# EAGLE design SparkFun_LS20126-Breakout-v11 (EAGLE 7.2.0)
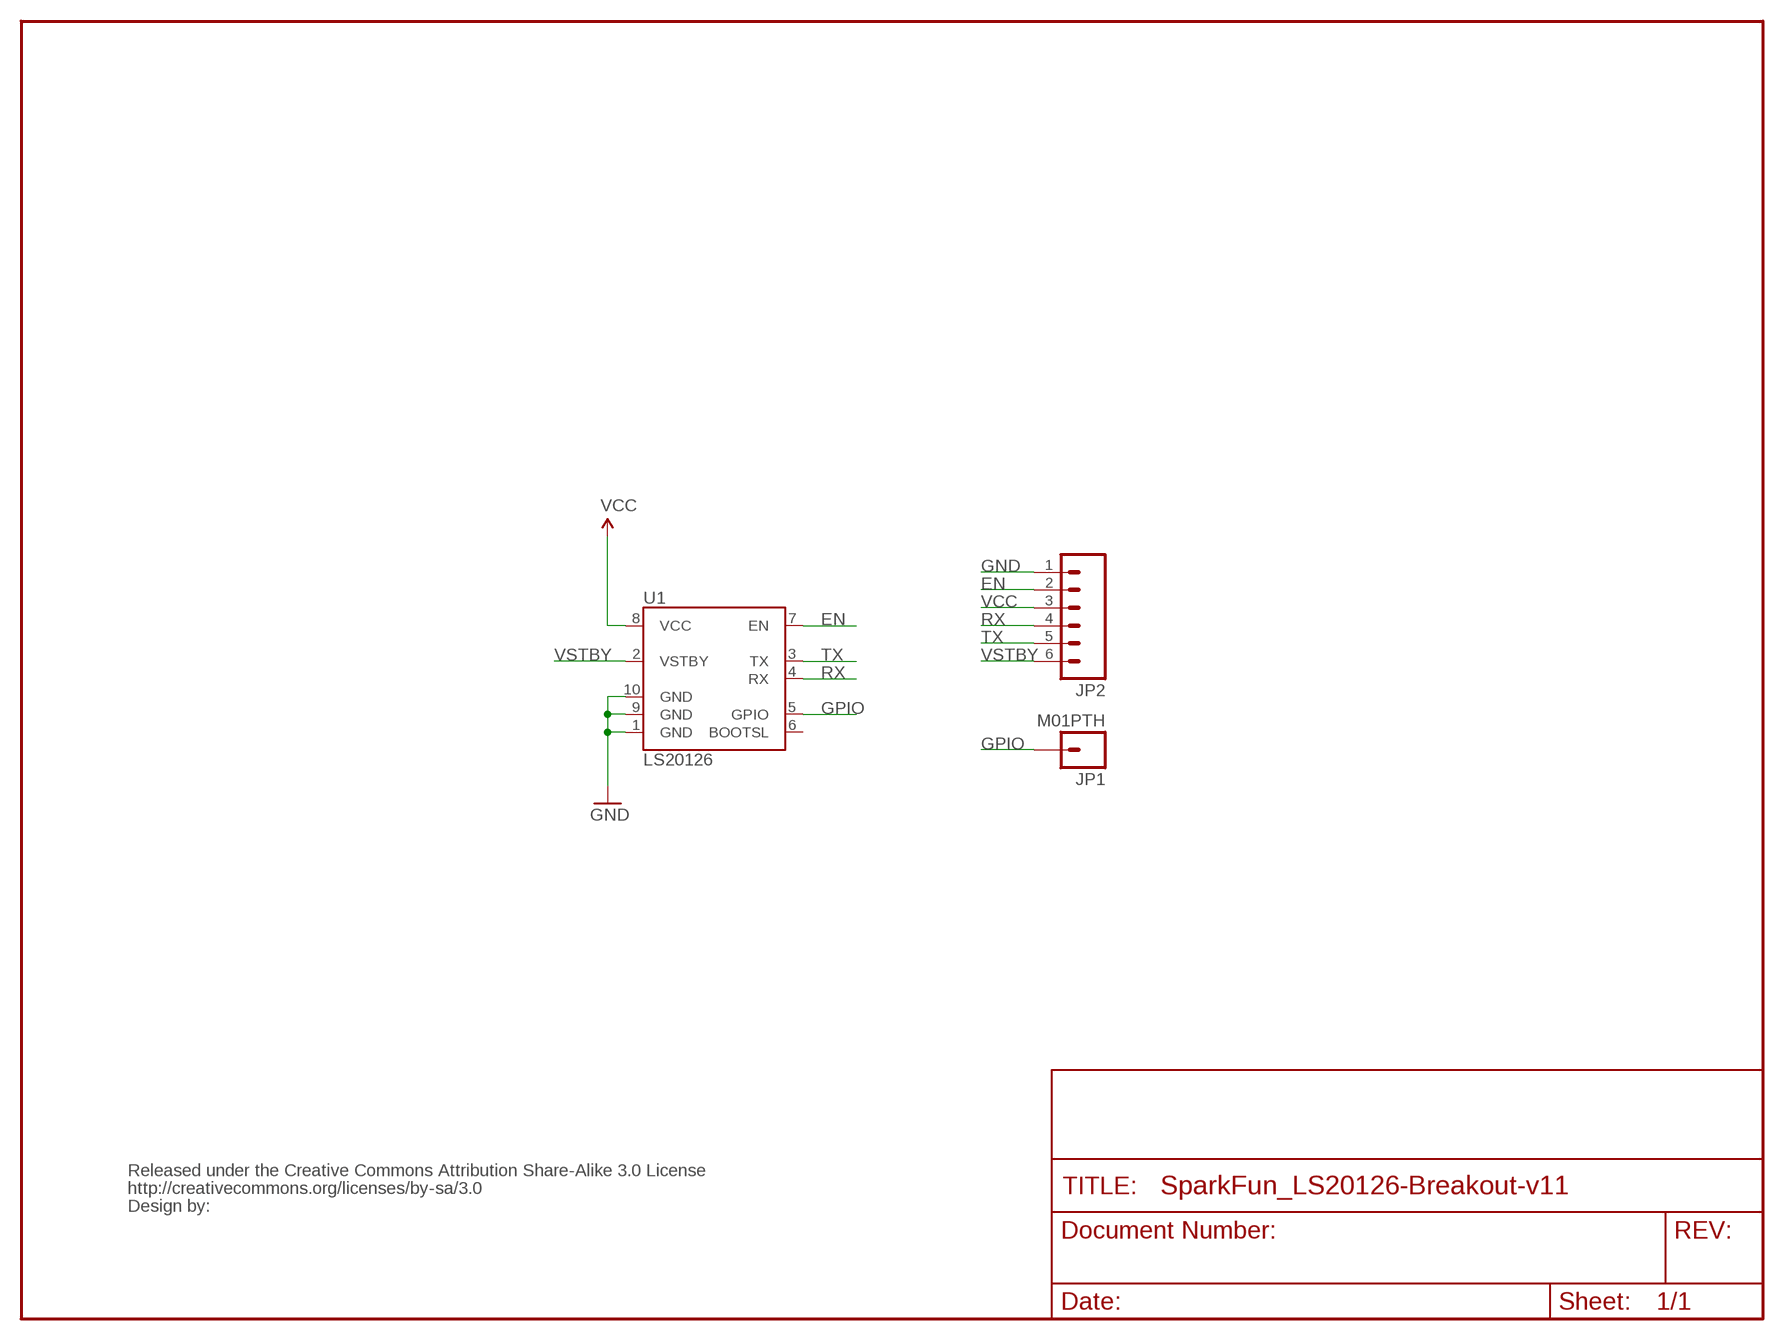
[diagram p0: schematic, sheet 1]

## Parts
JP1  M01PTH  [1X01]
JP2  M06SIP  [1X06]
U1  LS20126  [LS20126]
U$1  CREATIVE_COMMONS  [CREATIVE_COMMONS]

## Nets
EN: JP2.2 U1.7(EN)
GND: JP2.1 U1.1(GND) U1.9(GND) U1.10(GND)
GPIO: JP1.1 U1.5(GPIO)
RX: JP2.4 U1.4(RX)
TX: JP2.5 U1.3(TX)
VCC: JP2.3 U1.8(VCC)
VSTBY: JP2.6 U1.2(VSTBY)
Unconnected: U1.6(BOOTSL)

## Library data of the parts
JP1 = SparkFun:M01: Header 1 Standard 1-pin 0.1" header. Use with straight break away headers (SKU : PRT-00116), right angle break away headers (PRT-00553), swiss pins (PRT-00743), machine pins (PRT-00117), and female headers (PRT-00115).
JP2 = SparkFun:M06: Header 6 Standard 6-pin 0.1" header. Use with straight break away headers (SKU : PRT-00116), right angle break away headers (PRT-00553), swiss pins (PRT-00743), machine pins (PRT-00117), and female headers (PRT-00115). Molex polarized connector foot print use with SKU : PRT-08094 with associated crimp pins and housings. NOTES ON THE VARIANTS LOCK and LOCK_LONGPADS... This footprint was designed to help hold the alignment of a through-hole component (i.e. 6-pin header) while soldering it into place. You may notice that each hole has been shifted either up or down by 0.005 of an inch from it's more standard position (which is a perfectly straight line). This slight alteration caused the pins (the squares in the middle) to touch the edges of the holes. Because they are alternating, it causes a "brace" to hold the component in place. 0.005 has proven to be the perfect amount of "off-center" position when using our standard breakaway headers. Although looks a little odd when you look at the bare footprint, once you have a header in there, the alteration is very hard to notice. Also, if you push a header all the way into place, it is covered up entirely on the bottom side. This idea of altering the position of holes to aid alignment will be further integrated into the Sparkfun Library for other footprints. It can help hold any component with 3 or more connection pins.
U1 = SparkFun:LS20126: LS20126 20-Channel GPS Module SparkFun SKU# GPS-09838 The LOCOSYS LS20126 GPS smart antenna module is a high sensitivity, low power, SMD type, 20 channels with built-in magnetic sensor, 3-axial acceleration sensor L1 GPS receiver and 10mm patch antenna designed for portable applications.
U$1 = SparkFun:CREATIVE_COMMONS

## Board
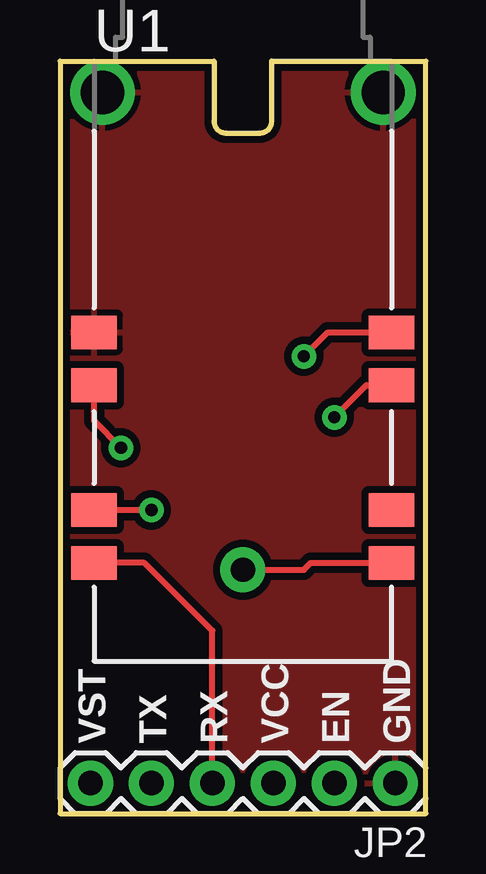
[diagram p1: board, top side]
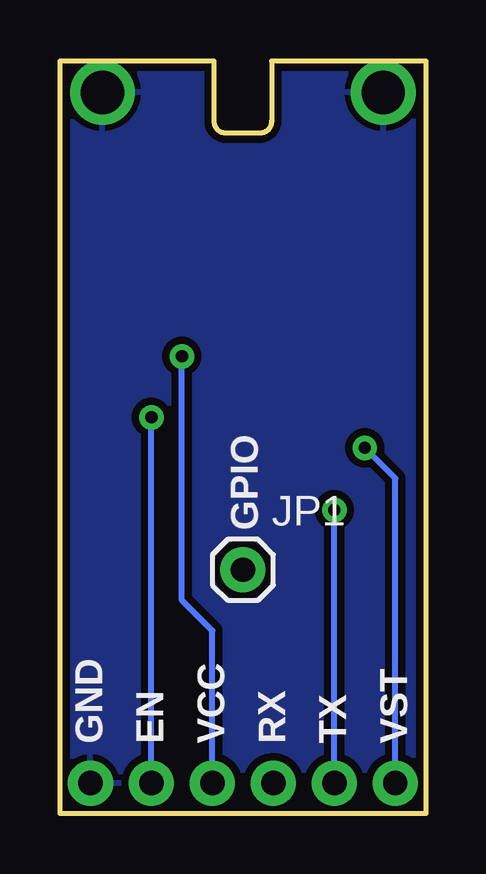
[diagram p2: board, bottom side, seen from below]

Size 15.24 x 31.35 mm. Coordinates in mm from the lower left corner, seen from the top.
Outline: 0,31.35 6.42,31.35 6.42,28.85 arc90 6.92,28.35 8.32,28.35 arc90 8.82,28.85 8.82,31.35 15.24,31.35 15.24,0 0,0 0,31.35
Copper layers (1*16): Top 0.035mm / dielectric 1.5mm / Bottom 0.035mm
Design rules "SparkFun": minimum track width 8mil, minimum drill 20mil, track to track 8mil, track to pad 8mil, pad to pad 8mil, via to via 8mil, smd to smd 8mil, copper to edge 8mil, drill to drill 8mil, minimum pad ring 12mil, minimum via ring 10mil, stop-mask expansion 4mil, vias tented up to drill 20mil, thermal gap 10mil

### Footprints (pad centres in the part's own frame; a part is rotated, then mirrored left to right if it is on the bottom)
1X01 = drill 1.016 pad 1.88: 1 0,0
1X06 = drill 1.016 pad 1.88: 1 0,0; 2 2.54,0; 3 5.08,0; 4 7.62,0; 5 10.16,0; 6 12.7,0
LS20126 = smd 1.9 x 1.4: 1 -6.2,13.7; 2 -6.2,11.5; 3 -6.2,6.3; 4 -6.2,4.1; 5 6.2,4.1; 6 6.2,6.3; 7 6.2,11.5; 8 6.2,13.7 | drill 1.8: 9 5.85,23.7; 10 -5.85,23.7

### Placement (x,y rotation side)
JP1  7.62,10.16 0 bottom
JP2  13.97,1.27 180 top
U1  7.62,6.35 0 top
U$1  48.26,-3.81 180 top  (outside the outline)

### Tracks (layer width: path | path; a pad name or v marks a point on that pad's centre or on a via)
EN  (via drill 0.51)
  Top 0.254: U1.7 12.77,17.85 v11.43,16.51
  Bottom 0.254: JP2.2 v11.43,16.51
GND
  pour Top (isolate 0.305): 0,31.35 15.24,31.35 15.24,0 0,0
  pour Bottom (isolate 0.305): 0,31.35 0,0 15.24,0 15.24,31.35
GPIO
  Top 0.254: U1.5 10.45,10.45 10.16,10.16 JP1.1
RX
  Top 0.254: U1.4 3.52,10.45 6.35,7.62 JP2.4
TX  (via drill 0.51)
  Top 0.254: v3.81,12.65 U1.3
  Bottom 0.254: JP2.5 v3.81,12.65
VCC  (via drill 0.51)
  Top 0.254: U1.8 11.16,20.05 v10.16,19.05
  Bottom 0.254: v10.16,19.05 10.16,8.89 8.89,7.62 JP2.3
VSTBY  (via drill 0.51)
  Top 0.254: U1.2 1.42,16.36 v2.54,15.24
  Bottom 0.254: v2.54,15.24 1.27,13.97 JP2.6

### Text on the board
tPlace: VST | TX | RX | VCC | EN | GND
bPlace: GPIO | VST | TX | RX | VCC | EN | GND